# Altium schematic sheet BottomSide.SchDoc
size Letter; DrawnBy: Adam Gilbert; Organization: Altium Limited; Address1: L3, 12a Rodborough Rd; Address2: Frenchs Forest; Address3: NSW; Address4: Australia 2086; DocumentNumber: 3; SheetNumber: 3; SheetTotal: 4
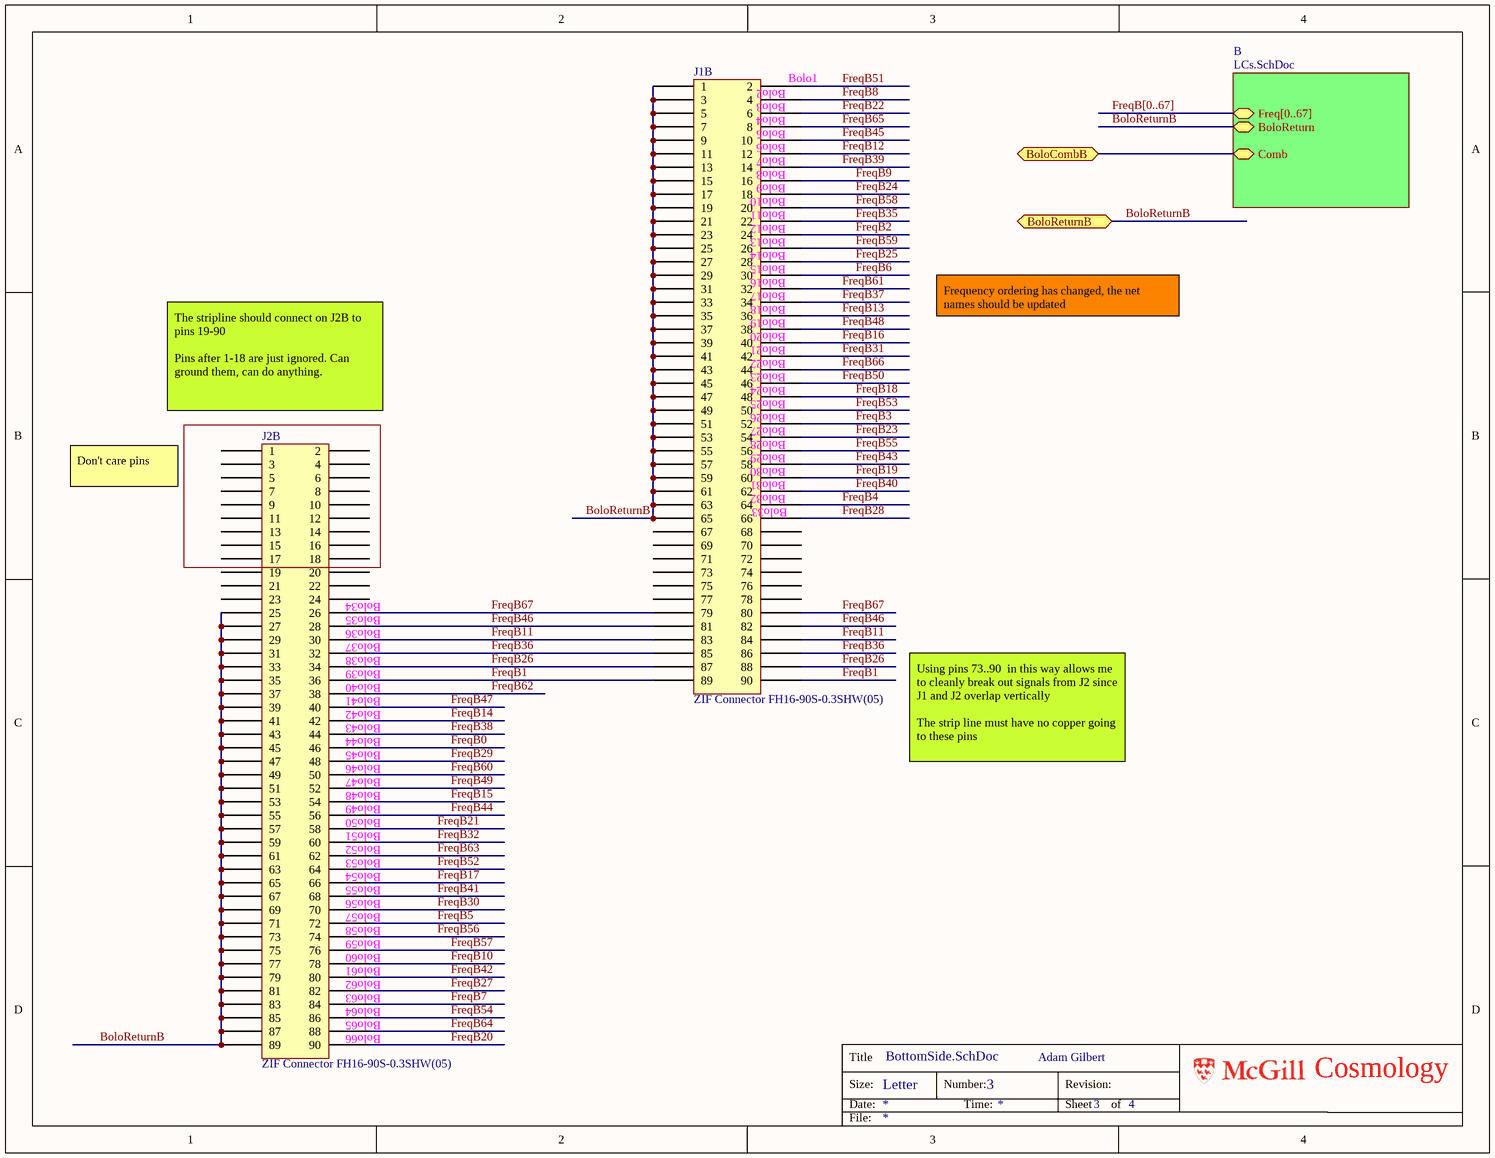
[diagram p0: BottomSide.SchDoc]

## Parts
J1B  ZIF Connector FH16-90S-0.3SHW(05)  [LCBoard_ZIFCon]
J2B  ZIF Connector FH16-90S-0.3SHW(05)  [LCBoard_ZIFCon]

## Sub-sheets
B = LCs.SchDoc: Freq[0..67], BoloReturn, Comb

## Ports
BoloCombB, BoloReturnB

## Nets
BoloCombB: port BoloCombB, sheet B/Comb
BoloReturnB: J1B.1 J1B.3 J1B.5 J1B.7 J1B.9 J1B.11 J1B.13 J1B.15 J1B.17 J1B.19 J1B.21 J1B.23 J1B.25 J1B.27 J1B.29 J1B.31 J1B.33 J1B.35 J1B.37 J1B.39 J1B.41 J1B.43 J1B.45 J1B.47 J1B.49 J1B.51 J1B.53 J1B.55 J1B.57 J1B.59 J1B.61 J1B.63 J1B.65 J2B.25 J2B.27 J2B.29 J2B.31 J2B.33 J2B.35 J2B.37 J2B.39 J2B.41 J2B.43 J2B.45 J2B.47 J2B.49 J2B.51 J2B.53 J2B.55 J2B.57 J2B.59 J2B.61 J2B.63 J2B.65 J2B.67 J2B.69 J2B.71 J2B.73 J2B.75 J2B.77 J2B.79 J2B.81 J2B.83 J2B.85 J2B.87 J2B.89 ; port BoloReturnB, sheet B/BoloReturn
FreqB0: J2B.46
FreqB1: J1B.89 J1B.90 J2B.36
FreqB2: J1B.24
FreqB3: J1B.52
FreqB4: J1B.64
FreqB5: J2B.72
FreqB6: J1B.30
FreqB7: J2B.84
FreqB8: J1B.4
FreqB9: J1B.16
FreqB10: J2B.78
FreqB11: J1B.83 J1B.84 J2B.30
FreqB12: J1B.12
FreqB13: J1B.36
FreqB14: J2B.42
FreqB15: J2B.54
FreqB16: J1B.40
FreqB17: J2B.66
FreqB18: J1B.48
FreqB19: J1B.60
FreqB20: J2B.90
FreqB21: J2B.58
FreqB22: J1B.6
FreqB23: J1B.54
FreqB24: J1B.18
FreqB25: J1B.28
FreqB26: J1B.87 J1B.88 J2B.34
FreqB27: J2B.82
FreqB28: J1B.66
FreqB29: J2B.48
FreqB30: J2B.70
FreqB31: J1B.42
FreqB32: J2B.60
FreqB35: J1B.22
FreqB36: J1B.85 J1B.86 J2B.32
FreqB37: J1B.34
FreqB38: J2B.44
FreqB39: J1B.14
FreqB40: J1B.62
FreqB41: J2B.68
FreqB42: J2B.80
FreqB43: J1B.58
FreqB44: J2B.56
FreqB45: J1B.10
FreqB46: J1B.81 J1B.82 J2B.28
FreqB47: J2B.40
FreqB48: J1B.38
FreqB49: J2B.52
FreqB50: J1B.46
FreqB51: J1B.2
FreqB52: J2B.64
FreqB53: J1B.50
FreqB54: J2B.86
FreqB55: J1B.56
FreqB56: J2B.74
FreqB57: J2B.76
FreqB58: J1B.20
FreqB59: J1B.26
FreqB60: J2B.50
FreqB61: J1B.32
FreqB62: J2B.38
FreqB63: J2B.62
FreqB64: J2B.88
FreqB65: J1B.8
FreqB66: J1B.44
FreqB67: J1B.79 J1B.80 J2B.26

Not connected (* = marked no-connect by the designer): J1B 67 68 69 70 71 72 73 74 75 76 77 78; J2B 1 2 3 4 5 6 7 8 9 10 11 12 13 14 15 16 17 18 19 20 21 22 23 24

## Buses and harness runs
bus FreqB[0..67] = sheet B/Freq[0..67]

## Notes on the sheet
- (near J1B) Bolo2
- (near J1B) Bolo3
- (near J1B) Bolo1
- (near J1B) Bolo4
- (near J1B) Bolo5
- (near J1B) Bolo6
- (near J1B) Bolo7
- (near J1B) Bolo8
- (near J1B) Bolo9
- (near J1B) Bolo10
- (near J1B) Bolo11
- (near J1B) Bolo12
- (near J1B) Bolo13
- (near J1B) Bolo14
- (near J1B) Bolo15
- (near J1B) Bolo16
- (near J1B) Bolo17
- (near J1B) Bolo18
- (near J1B) Bolo19
- (near J1B) Bolo20
- (near J1B) Bolo21
- (near J1B) Bolo22
- (near J1B) Bolo23
- Frequency ordering has changed, the net names should be updated
- (near J2B) The stripline should connect on J2B to pins 19-90
  Pins after 1-18 are just ignored. Can ground them, can do anything.
- (near J1B) Bolo24
- (near J1B) Bolo25
- (near J1B) Bolo26
- (near J1B) Bolo27
- (near J1B) Bolo28
- Don't care pins
- (near J1B) Bolo29
- (near J1B) Bolo30
- (near J1B) Bolo31
- (near J1B) Bolo32
- (near J1B) Bolo33
- (near J2B) Bolo34
- (near J2B) Bolo35
- (near J2B) Bolo36
- (near J2B) Bolo37
- (near J2B) Bolo38
- (near J2B) Bolo39
- (near J2B) Bolo40
- (near J2B) Bolo41
- (near J2B) Bolo42
- (near J2B) Bolo43
- (near J2B) Bolo44
- (near J2B) Bolo45
- (near J2B) Bolo46
- (near J2B) Bolo47
- Using pins 73..90  in this way allows me to cleanly break out signals from J2 since J1 and J2 overlap vertically
  The strip line must have no copper going to these pins
- (near J2B) Bolo48
- (near J2B) Bolo49
- (near J2B) Bolo50
- (near J2B) Bolo51
- (near J2B) Bolo52
- (near J2B) Bolo53
- (near J2B) Bolo54
- (near J2B) Bolo55
- (near J2B) Bolo56
- (near J2B) Bolo57
- (near J2B) Bolo58
- (near J2B) Bolo59
- (near J2B) Bolo60
- (near J2B) Bolo61
- (near J2B) Bolo62
- (near J2B) Bolo63
- (near J2B) Bolo64
- (near J2B) Bolo65
- (near J2B) Bolo66
- Title
- Size:
- Date:
- Letter
- Number:
- Time:
- Revision:
- Sheet
- of
- Cosmology
- File:

## Library data of the parts
J1B J2B = LCboard_FH16-90S-0.3SHW(05)